# Altium schematic sheet PowerSchematic.SchDoc
size A4; SheetNumber: 1; SheetTotal: 3
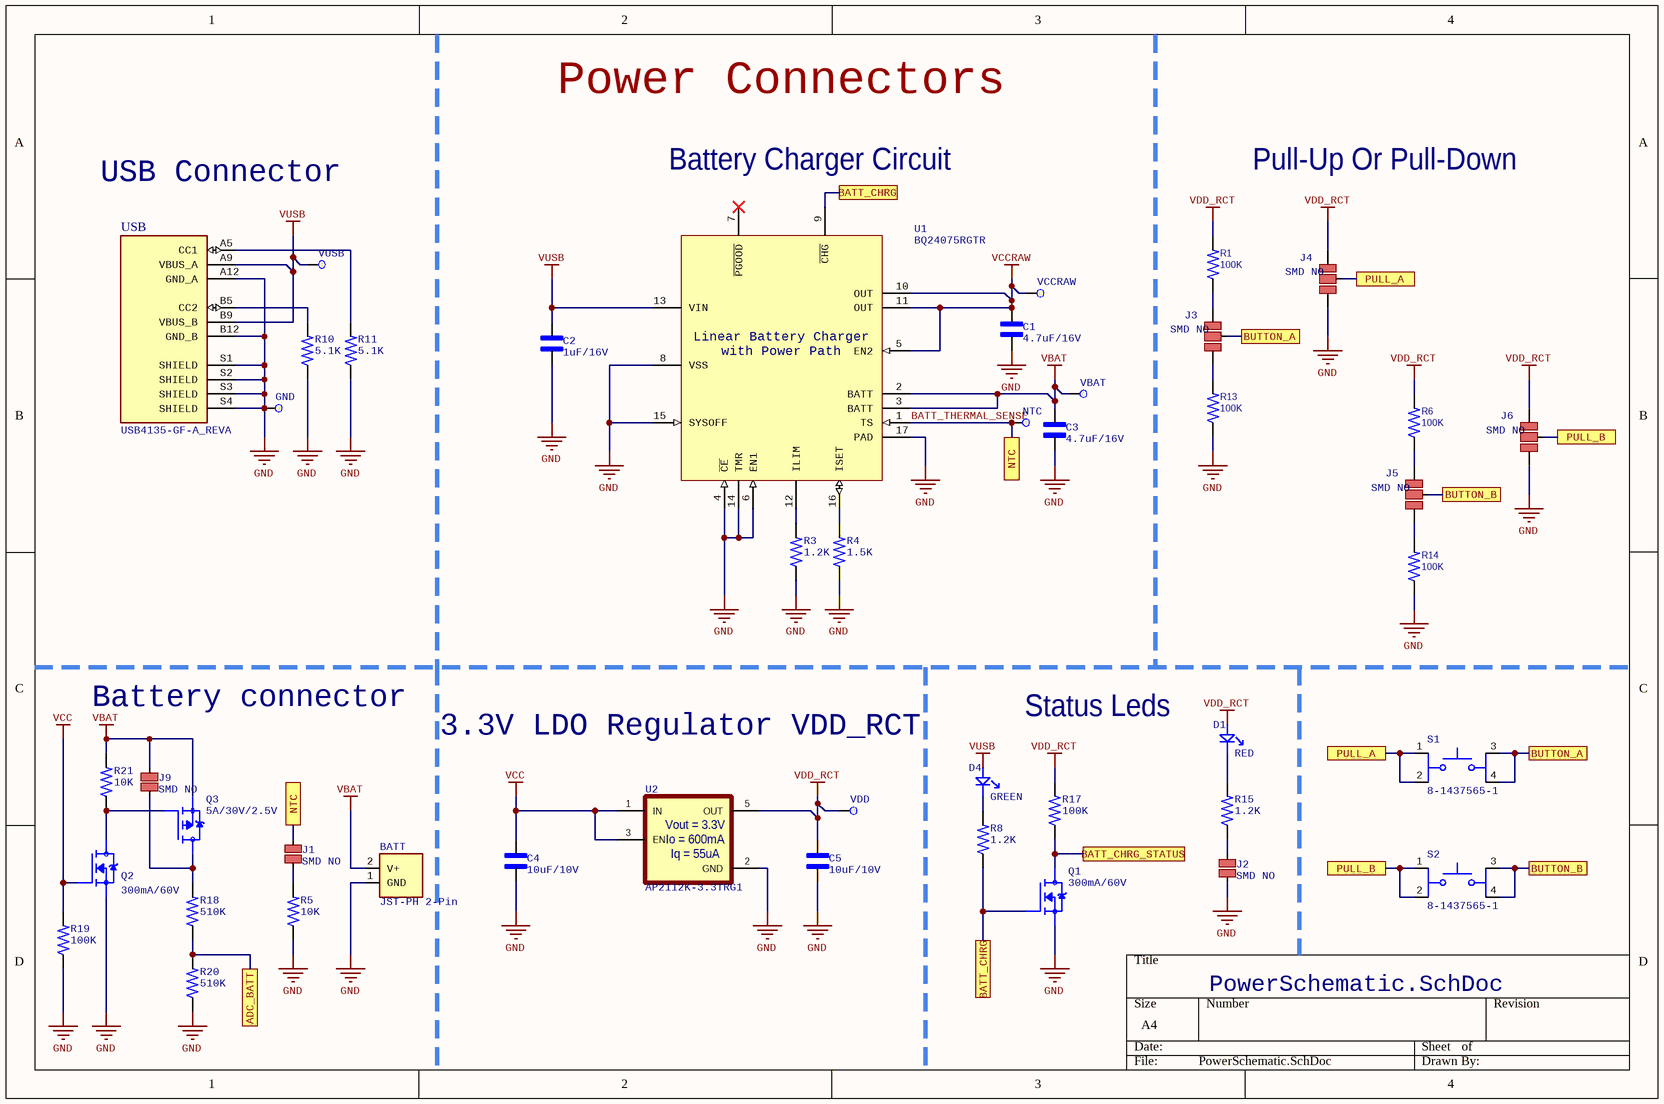
[diagram p0: PowerSchematic.SchDoc]

## Parts
BATT  JST-PH 2-Pin  [JST_B2B-PH-K-S(LF)(SN)]
C1  4.7uF/16V  [C0603]
C2  1uF/16V  [C0603]
C3  4.7uF/16V  [C0603]
C4  10uF/10V  [C0603]
C5  10uF/10V  [C0603]
D1  RED  [LED 0603]
D4  GREEN  [LED 0603]
GND  Test point 1.2mm  [TEST_POINT_1.2MM]  (value not drawn)  (no BOM)
J1  SMD NO  [JUMPER_SMD_NO]  (net tie, no BOM)
J2  SMD NO  [JUMPER_SMD_NO]  (net tie, no BOM)
J3  SMD NO  [JUMPER_SMD_NO_2WAY]  (net tie, no BOM)
J4  SMD NO  [JUMPER_SMD_NO_2WAY]  (net tie, no BOM)
J5  SMD NO  [JUMPER_SMD_NO_2WAY]  (net tie, no BOM)
J6  SMD NO  [JUMPER_SMD_NO_2WAY]  (net tie, no BOM)
J9  SMD NO  [JUMPER_SMD_NO]  (net tie, no BOM)
NTC  Test point 1.2mm  [TEST_POINT_1.2MM]  (value not drawn)  (no BOM)
Q1  300mA/60V  [SOT-23-3]
Q2  300mA/60V  [SOT-23-3]
Q3  5A/30V/2.5V  [SOT-23-3]
R1  100K  [R0603]
R3  1.2K  [R0603]
R4  1.5K  [R0603]
R5  10K  [R0603]
R6  100K  [R0603]
R8  1.2K  [R0603]
R10  5.1K  [R0603]
R11  5.1K  [R0603]
R13  100K  [R0603]
R14  100K  [R0603]
R15  1.2K  [R0603]
R17  100K  [R0603]
R18  510K  [R0603]
R19  100K  [R0603]
R20  510K  [R0603]
R21  10K  [R0603]
S1  8-1437565-1  [SW_8-1437565-1]
S2  8-1437565-1  [SW_8-1437565-1]
U1  BQ24075RGTR  [VQFN16]
U2  AP2112K-3.3TRG1  [SOT-25-5]
USB  USB4135-GF-A_REVA  [GCT_USB4135 16-pin]
VBAT  Test point 1.2mm  [TEST_POINT_1.2MM]  (value not drawn)  (no BOM)
VCCRAW  Test point 1.2mm  [TEST_POINT_1.2MM]  (value not drawn)  (no BOM)
VDD  Test point 1.2mm  [TEST_POINT_1.2MM]  (value not drawn)  (no BOM)
VUSB  Test point 1.2mm  [TEST_POINT_1.2MM]  (value not drawn)  (no BOM)

## Ports
ADC_BATT (see Peripherals[4C]), BATT_CHRG (see PowerSchematic[3A]), BATT_CHRG (see PowerSchematic[3D]), BATT_CHRG_STATUS (see Peripherals[4C]), BUTTON_A (see Peripherals[1C], PowerSchematic[3B]), BUTTON_A (see Peripherals[1C], PowerSchematic[4C]), BUTTON_B (see Peripherals[1C], PowerSchematic[4B]), BUTTON_B (see Peripherals[1C], PowerSchematic[4D]), NTC (see PowerSchematic[1D]), NTC (see PowerSchematic[3B]), PULL_A (see PowerSchematic[4B]), PULL_A (see PowerSchematic[4C]), PULL_B (see PowerSchematic[4B]), PULL_B (see PowerSchematic[4D])

## Nets
GND: BATT.1(GND) C1.2 C2.2 C3.2 C4.2 C5.2 GND.1 J2.2 J4.1 J6.1 Q1.2(S) Q2.2(S) R3.1 R4.1 R5.1 R10.1 R11.1 R13.1 R14.1 R19.1 R20.1 U1.4(~{CE}) U1.6(EN1) U1.8(VSS) U1.14(TMR) U1.15(SYSOFF) U1.17(PAD) U2.2(GND) USB.A12(GND_A) USB.B12(GND_B) USB.S1(SHIELD) USB.S2(SHIELD) USB.S3(SHIELD) USB.S4(SHIELD)
VBAT: BATT.2(V+) C3.1 J9.1 Q3.2(S) R21.2 U1.2(BATT) U1.3(BATT) VBAT.1
VCC: C4.1 Q2.1(G) R19.2 U2.1(IN) U2.3(EN)
VCCRAW: C1.1 U1.5(EN2) U1.10(OUT) U1.11(OUT) VCCRAW.1
VDD_RCT: C5.1 D1.1(A) J4.3 J6.3 R1.2 R6.2 R17.2 U2.5(OUT) VDD.1
VUSB: C2.1 D4.1(A) U1.13(VIN) USB.A9(VBUS_A) USB.B9(VBUS_B) VUSB.1
ADC_BATT: R18.1 R20.2 ; port ADC_BATT
BATT_CHRG: Q1.1(G) R8.1 U1.9(~{CHG}) ; port BATT_CHRG
BATT_CHRG_STATUS: Q1.3(D) R17.1 ; port BATT_CHRG_STATUS
BATT_THERMAL_SENSE: J1.1 NTC.1 U1.1(TS) ; port NTC
BUTTON_A: J3.2 S1.3 S1.4 ; port BUTTON_A
BUTTON_B: J5.2 S2.3 S2.4 ; port BUTTON_B
PULL_A: J4.2 S1.1 S1.2 ; port PULL_A
PULL_B: J6.2 S2.1 S2.2 ; port PULL_B
NetD1_2: D1.2(K) R15.2
NetD4_2: D4.2(K) R8.2
NetJ1_2: J1.2 R5.2
NetJ2_1: J2.1 R15.1
NetJ3_1: J3.1 R13.2
NetJ3_3: J3.3 R1.1
NetJ5_1: J5.1 R14.2
NetJ5_3: J5.3 R6.1
NetJ9_2: J9.2 Q3.3(D) R18.2
NetQ2_3: Q2.3(D) Q3.1(G) R21.1
NetR3_2: R3.2 U1.12(ILIM)
NetR4_2: R4.2 U1.16(ISET)
NetR10_2: R10.2 USB.B5(CC2)
NetR11_2: R11.2 USB.A5(CC1)

Not connected (* = marked no-connect by the designer): U1 7(~{PGOOD})*

## Notes on the sheet
- Power Connectors
- USB Connector
- Battery Charger Circuit
- Pull-Up Or Pull-Down
- Battery connector
- 3.3V LDO Regulator VDD_RCT
- Status Leds
- (in symbol AP2112K-3.3TRG1) Vout = 3.3V; Io = 600mA; Iq = 55uA
- (in symbol BQ24075RGTR) Linear Battery Charger; with Power Path

## Library data of the parts
BATT = JST-PH 2-Pin: JST (JAPAN SOLDERLESS TERMINALS) - B2B-PH-K-S(LF)(SN) - Pin Header, Top Entry, Wire-to-Board, 2 mm, 1 Rows, 2 Contacts, Through Hole, PH Series; Supplier 1: LCSC; Supplier Part Number 1: C131337; Manufacturer: JST; Manufacturer Part Number: B2B-PH-K-S(LF)(SN); RoHS: Yes; Category: Connectors; Stock 1: 3352380; Pricing 1: 20=0.03960, 200=0.03310, 600=0.02840, 2000=0.02160, 10000=0.02100, 20000=0.02070 (USD); Weight: 0.0625lb; Length: 0.2inch; Width: 0.24inch; Height: 0.35inch
C1 C3 = C0603 4.7uF/16V: 0603 4.7 uF 16 V ±10% Tolerance X5R Multilayer Ceramic Capacitor; Manufacturer: Murata; Manufacturer Part Number: GRT188R61C475KE13D; Value: 4.7uF; Voltage Rating: 16V; Supplier 1: Mouser; Supplier Part Number 1: 81-GRT188R61C475KE3D; RoHS: Yes; Category: Ceramic Capacitors; Stock 1: 39950; Pricing 1: 1=0.16, 10=0.066, 50=0.066, 100=0.038, 1000=0.034, 10000=0.029 (USD); Mounting Technology: Surface Mount; Case/Package: 0603; Case Code (Metric): 1608; Case Code (Imperial): 0603; Min Operating Temperature: -55°C; Max Operating Temperature: 85°C; Packaging: Cut Tape; Tolerance: 10%; Series: GRT; Length: 0.063inch; Width: 0.031inch; Thickness: 0.035inch; Ratings: AEC-Q200; RoHS Compliant: Yes
C2 = C0603 1uF/16V X5R: MLCC 1uF 16V X5R 10% SMD 0603 85C Paper T/R; Manufacturer: Yageo; Manufacturer Part Number: CC0603KRX5R7BB105; Dissipation Factor: 7%; Supplier 1: Mouser; Supplier Part Number 1: 603-CC603KRX5R7BB105; RoHS: Yes; Category: Ceramic Capacitors; Stock 1: 726921; Pricing 1: 1=0.17000, 10=0.09100, 50=0.09100, 100=0.04100, 1000=0.03400, 10000=0.02100 (USD); Mount: Surface Mount; Case/Package: 0603; Number of Pins: 2; Case Code (Imperial): 0603; Case Code (Metric): 1608; Min Operating Temperature: -55°C; Max Operating Temperature: 85°C; Capacitance: 1uF; Tolerance: 10%; Dielectric: X5R; Voltage Rating: 16V; Voltage Rating (DC): 16V; Packaging: Tape and Reel; Package Quantity: 4000; Termination: SMD/SMT; Resistor Type: Ceramic; Series: CC; Construction: Flat; Length: 1.6mm; Width: 0.8mm; Height: 0.8mm; Thickness: 0.035inch; Depth: 0.8mm; Radiation Hardening: No; REACH SVHC: Unknown; Lead Free: Lead Free; Halogen Free: Halogen Free; RoHS Compliant: Yes
C4 C5 = C0603 10uF/10V: MLCC 10uF 10V X5R 20% 0603; Manufacturer: Samsung; Manufacturer Part Number: CL10A106MP8NNND; Supplier 1: Mouser; Supplier Part Number 1: 187-CL10A106MP8NNND; RoHS: Yes; Category: Ceramic Capacitors; Stock 1: 58774; Pricing 1: 1=0.20000, 10=0.14000, 50=0.14000, 100=0.06600, 1000=0.03900, 10000=0.03000 (USD); Supplier 2: Mouser; Supplier Part Number 2: 963-LMK107BBJ106MAHT; RoHS Compliant: Yes
D1 = LED 0603 RED: Red 625nm LED Indication - Discrete 2V 0603; Manufacturer: Wurth Electronics; Manufacturer Part Number: 150060RS55040; Luminous Intensity: 90mcd; Lens Style: Flat; Viewing Angle: 140°; Dominant Wavelength: 624nm; Test Current: 20mA; Lens Transparency: Diffused; Lens Size: 0.8mm; Supplier 1: Mouser; Supplier Part Number 1: 710-150060RS55040; RoHS: No; Category: LEDs; Stock 1: 8586; Pricing 1: 1=0.18000, 10=0.16200, 100=0.14700, 500=0.13200, 1000=0.11700, 2000=0.11700 (USD); Mount: Surface Mount; Case/Package: 0603; Color: Red; Forward Voltage: 2V; Packaging: Tape and Reel; Height: 0.5mm; Case Code (Imperial): 0603; Case Code (Metric): 1608; Length: 1.6mm; Width: 0.8mm
D4 = LED 0603 GREEN: Green 575nm LED Indication - Discrete 2V 0603; Manufacturer: Wurth Electronics; Manufacturer Part Number: 150060VS55040; Luminous Intensity: 60mcd; Lens Style: Flat; Viewing Angle: 140°; Dominant Wavelength: 573nm; Test Current: 20mA; Lens Transparency: Diffused; Lens Size: 0.8mm; Supplier 1: Mouser; Supplier Part Number 1: 710-150060VS55040; RoHS: No; Category: LEDs; Stock 1: 24940; Pricing 1: 1=0,18000, 10=0,16200, 50=0,16200, 100=0,14700, 1000=0,11700, 10000=0,11700 (USD); Mount: Surface Mount; Case/Package: 0603; Color: Green; Forward Voltage: 2V; Packaging: Cut Tape; Height: 0.5mm; Case Code (Imperial): 0603; Case Code (Metric): 1608; Length: 1.6mm; Width: 0.8mm
GND NTC VBAT VCCRAW VDD VUSB = Test point: SMD test point
J1 J2 J9 = JUMPER_SMD_NO: Rule: UNIONINDEX=0|RULEKIND=ShortCircuit|NETSCOPE=AnyNet|LAYERKIND=SameLayer|NAME=Schematic Short-Circuit Constraint|ALLOWED=TRUE|UNIT=Imperial
J3-J6 = JUMPER_SMD_NO_2WAY
Q1 Q2 = MOSFET N-CH 2N7002,215: Trans MOSFET N-CH 60V 0.3A 3-Pin TO-236AB T/R; Manufacturer: Nexperia; Supplier 1: Mouser; Supplier Part Number 1: 771-2N7002-T/R; Manufacturer Part Number: 2N7002,215; RoHS: No; Category: MOSFETs; Stock 1: 82531; Pricing 1: 1=0.16000, 10=0.13800, 100=0.05900, 500=0.04800, 1000=0.03300, 3000=0.02500, 9000=0.02200, 24000=0.02000, 45000=0.01500 (USD)
Q3 = MOSFET P-CH 30V/5A SI2347DS-T1-GE3: P-Channel 30 V 42 mOhm 22 nC Surface Mount Power Mosfet - SOT-23-3; Manufacturer: Vishay Semiconductors; Rise Time: 6ns; Rds On Max: 42mR; Input Capacitance: 705pF; Drain to Source Voltage (Vdss): 30V; Continuous Drain Current (ID): 3.8A; Max Power Dissipation: 1.7W; Fall Time: 9ns; Gate to Source Voltage (Vgs): 20V; Drain to Source Resistance: 68mR; Turn-Off Delay Time: 19ns; Number of Elements: 1; Threshold Voltage: -2.5V; Element Configuration: Single; Drain to Source Breakdown Voltage: -30V; Supplier 1: Mouser; Supplier Part Number 1: 78-SI2347DS-T1-GE3; Manufacturer Part Number: Si2347DS-T1-GE3; RoHS: Yes; Category: MOSFETs; Stock 1: 90370; Pricing 1: 1=0.41000, 10=0.27600, 50=0.27600, 100=0.14500, 1000=0.10000, 10000=0.07700 (USD); Mount: Surface Mount; Case/Package: SOT-23-3; Number of Pins: 3; Contact Plating: Tin,Matte; Min Operating Temperature: -55°C; Max Operating Temperature: 150°C; Packaging: Tape and Reel; Package Quantity: 3000; Power Dissipation: 1.7W; Polarity: P-CHANNEL; Series: TrenchFET®; Radiation Hardening: No; REACH SVHC: No SVHC; Lead Free: Lead Free; RoHS Compliant: Yes
R1 R6 R13 R14 = R0603 100K: RES 0603 100K OHM 1% 1/10W; Manufacturer: Yageo; Manufacturer Part Number: RC0603FR-07100KL; Resistance: 100kR; Power Rating: 100mW; Voltage Rating: 50V; Temperature Coefficient: 100ppm/°C; Working Voltage: 75V; RoHS: Yes; Category: Chip SMD Resistors; Stock 1: 4536807; Pricing 1: 1=0.10000, 10=0.02100, 100=0.00900, 1000=0.00400, 5000=0.00300, 10000=0.00200 (USD); Case/Package: 0603; Number of Pins: 2; Case Code (Imperial): 0603; Case Code (Metric): 1608; Min Operating Temperature: -55°C; Max Operating Temperature: 155°C; Tolerance: 1%; Packaging: Tape and Reel; Resistor Type: Thick Film; Termination: SMD/SMT; Voltage Rating (DC): 50V; Length: 1.6mm; Depth: 0.8mm; REACH SVHC: No SVHC; Military Standard: Not; Lead Free: Lead Free; Supplier 1: Mouser; Supplier Part Number 1: 603-RC0603FR-07100KL; Number of Terminations: 2; Height: 0.45mm; Width: 0.8mm
R3 R8 R15 = R0603 1.2K: RES 0603 1.2K OHM 1% 1/10W; Manufacturer: Yageo; Manufacturer Part Number: RC0603FR-071K2L; Power Rating: 100mW; Voltage Rating: 50V; Resistance: 1.2kR; Temperature Coefficient: 100ppm/°C; Supplier 1: Mouser; Supplier Part Number 1: 603-RC0603FR-071K2L; RoHS: Yes; Category: Chip SMD Resistors; Stock 1: 27884; Pricing 1: 1=0.10000, 10=0.02400, 50=0.02400, 100=0.01000, 1000=0.00400, 10000=0.00300 (USD); Case/Package: 0603; Number of Pins: 2; Case Code (Imperial): 0603; Case Code (Metric): 1608; Size Code: 0603; Min Operating Temperature: -55°C; Max Operating Temperature: 155°C; Tolerance: 1%; Voltage Rating (DC): 50V; Packaging: Tape and Reel; Termination: SMD/SMT; Resistor Type: Thick Film; Features: Moisture Resistant; Series: RC; Max Power Dissipation: 100mW; Number of Terminations: 2; Construction: Rectangular; Resistance Tolerance: 1%; Length: 1.6mm; Width: 0.8mm; Height: 0.45mm; Depth: 0.8mm; REACH SVHC: No SVHC; Military Standard: Not; Lead Free: Lead Free; RoHS Compliant: Yes; ComponentLink1URL: http://www.farnell.com/datasheets/443971.pdf?src-supplier=Farnell; ComponentLink1Description: http://www.farnell.com/datasheets/443971.pdf?src-supplier=Farnell; ComponentLink2URL: http://www.farnell.com/datasheets/1868787.pdf?src-supplier=Farnell; ComponentLink2Description: http://www.farnell.com/datasheets/1868787.pdf?src-supplier=Farnell; ComponentLink3URL: http://www.farnell.com/datasheets/2167052.pdf?src-supplier=Farnell; ComponentLink3Description: http://www.farnell.com/datasheets/2167052.pdf?src-supplier=Farnell; ComponentLink4URL: http://www.mouser.com/ds/2/447/RC0603-272842.pdf?src-supplier=Mouser; ComponentLink4Description: http://www.mouser.com/ds/2/447/RC0603-272842.pdf?src-supplier=Mouser; ComponentLink5URL: http://components.arrow.com/part/dataview/0323_00047720?src-supplier=Arrow+Europe; ComponentLink5Description: http://components.arrow.com/part/dataview/0323_00047720?src-supplier=Arrow+Europe; ComponentLink6URL: http://www.farnell.com/datasheets/443971.pdf?src-supplier=Element14; ComponentLink6Description: http://www.farnell.com/datasheets/443971.pdf?src-supplier=Element14; ComponentLink7URL: http://www.farnell.com/datasheets/2167052.pdf?src-supplier=Newark; ComponentLink7Description: http://www.farnell.com/datasheets/2167052.pdf?src-supplier=Newark; ComponentLink8URL: http://www.farnell.com/datasheets/1868787.pdf?src-supplier=Element14; ComponentLink8Description: http://www.farnell.com/datasheets/1868787.pdf?src-supplier=Element14; ComponentLink9URL: http://www.farnell.com/datasheets/2167052.pdf?src-supplier=Element14; ComponentLink9Description: http://www.farnell.com/datasheets/2167052.pdf?src-supplier=Element14; ComponentLink10URL: http://www.yageo.com/documents/recent/PYu-RC0603_51_RoHS_L_7.pdf?src-supplier=Future+Electronics; ComponentLink10Description: http://www.yageo.com/documents/recent/PYu-RC0603_51_RoHS_L_7.pdf?src-supplier=Future+Electronics; ComponentLink11URL: https://www.verical.com/server-webapp/html/getDatasheet?partID=326670&src-supplier=Verical; ComponentLink11Description: https://www.verical.com/server-webapp/html/getDatasheet?partID=326670&src-supplier=Verical; ComponentLink12URL: http://www.farnell.com/datasheets/1868787.pdf?src-supplier=Newark; ComponentLink12Description: http://www.farnell.com/datasheets/1868787.pdf?src-supplier=Newark; ComponentLink13URL: http://www.yageo.com/documents/recent/PYu-RC_Group_51_RoHS_L_9.pdf?src-supplier=Digi-Key; ComponentLink13Description: http://www.yageo.com/documents/recent/PYu-RC_Group_51_RoHS_L_9.pdf?src-supplier=Digi-Key; ComponentLink14URL: http://www.yageo.com/documents/recent/PYu-RC_Group_51_RoHS_L_10.pdf?src-supplier=Digi-Key; ComponentLink14Description: http://www.yageo.com/documents/recent/PYu-RC_Group_51_RoHS_L_10.pdf?src-supplier=Digi-Key
R4 = R0603 1.5K: RES 0603 1.5K OHM 0.5% 1/10W; Manufacturer: Yageo; Manufacturer Part Number: RC0603FR-071K5L; Tolerance: 1%; Resistance: 1.5kR; Temperature Coefficient: 100ppm/°C; Voltage Rating (DC): 50V; Power Rating: 100mW; Supplier 1: Mouser; Supplier Part Number 1: 603-RC0603FR-071K5L; RoHS: Yes; Category: Chip SMD Resistors; Stock 1: 312486; Pricing 1: 1=0.10000, 10=0.01800, 50=0.01800, 100=0.00600, 1000=0.00500, 10000=0.00300 (USD); Case/Package: 0603; Number of Pins: 2; Case Code (Metric): 1608; Case Code (Imperial): 0603; Min Operating Temperature: -55°C; Max Operating Temperature: 155°C; Packaging: Tape and Reel; Resistor Type: Thick Film; Voltage Rating: 50V; Package Quantity: 1; Number of Terminations: 2; Termination: SMD/SMT; Max Power Dissipation: 100mW; Features: Moisture Resistant; Length: 0.063inch; Width: 0.031inch; Height: 0.022inch; Depth: 0.8mm; REACH SVHC: No SVHC; Lead Free: Lead Free; Military Standard: Not
R5 R21 = R0603 10K: SMD Chip Resistor, 10 kOhm, ± 1%, 100 mW, 0603 [1608 Metric], Thick Film, Anti-Sulfur; Manufacturer: Yageo; Manufacturer Part Number: AF0603FR-0710KL; Power Rating: 100mW; Temperature Coefficient: 100ppm/°C; Voltage Rating: 50V; Value: 10kR; Supplier 1: Mouser; Supplier Part Number 1: 603-AF0603FR-0710KL; RoHS: Yes; Category: Chip SMD Resistors; Case/Package: 0603; Case Code (Imperial): 0603; Case Code (Metric): 1608; Min Operating Temperature: -55°C; Max Operating Temperature: 155°C; Tolerance: 1%; Packaging: Tape and Reel; Package Quantity: 1; Termination: SMD/SMT; Number of Terminations: 2; Max Power Dissipation: 100mW; Features: Moisture Resistant,Anti-Sulfur; Length: 0.063inch; Width: 0.031inch; Height: 0.022inch; Lead Free: 5697LeadFree; Supplier 2: Mouser; Supplier Part Number 2: 667-ERJ-3EKF1002V; Stock 3: 5000; Pricing 3: 5000=0.00223, 10000=0.00219, 20000=0.00213 (USD); Series: AF; RoHS Compliant: Yes
R10 R11 = R0603 5.1K: RES 0603 5.1K OHM 1% 1/10W; Manufacturer: Yageo; Manufacturer Part Number: RC0603FR-075K1L; Power Rating: 100mW; Temperature Coefficient: 100ppm/°C; Resistance: 5.1kR; Voltage Rating: 50V; Supplier 1: Mouser; Supplier Part Number 1: 603-RC0603FR-075K1L; RoHS: Yes; Category: Chip SMD Resistors; Stock 1: 557916; Case/Package: 0603; Number of Pins: 2; Case Code (Imperial): 0603; Case Code (Metric): 1608; Min Operating Temperature: -55°C; Max Operating Temperature: 155°C; Tolerance: 1%; Packaging: Tape and Reel; Package Quantity: 1; Termination: SMD/SMT; Resistor Type: Thick Film; Number of Terminations: 2; Max Power Dissipation: 100mW; Voltage Rating (DC): 50V; Features: Moisture Resistant; Length: 0.063inch; Width: 0.031inch; Height: 0.022inch; Depth: 0.8mm; REACH SVHC: No SVHC; Military Standard: Not; Lead Free: Lead Free
R17 R19 = R0603 100K: RES 0603 100K OHM 1% 1/10W; Manufacturer: Yageo; Manufacturer Part Number: RC0603FR-07100KL; Power Rating: 100mW; Voltage Rating: 50V; Resistance: 100kR; Temperature Coefficient: 100ppm/°C; Working Voltage: 75V; Supplier 1: Mouser; Supplier Part Number 1: 603-RC0603FR-07100KL; RoHS: Yes; Category: Chip SMD Resistors; Stock 1: 4536807; Pricing 1: 1=0.10000, 10=0.02100, 100=0.00900, 1000=0.00400, 5000=0.00300, 10000=0.00200 (USD); Case/Package: 0603; Number of Pins: 2; Case Code (Imperial): 0603; Case Code (Metric): 1608; Min Operating Temperature: -55°C; Max Operating Temperature: 155°C; Tolerance: 1%; Voltage Rating (DC): 50V; Packaging: Tape and Reel; Termination: SMD/SMT; Resistor Type: Thick Film; Number of Terminations: 2; Length: 1.6mm; Width: 0.8mm; Height: 0.45mm; Depth: 0.8mm; REACH SVHC: No SVHC; Military Standard: Not; Lead Free: Lead Free
R18 R20 = R0603 510K: RES 0603 510K OHM 1% 1/10W; Manufacturer: TE Connectivity; Manufacturer Part Number: CPF0603B510KE; Tolerance: 0.1%; Temperature Coefficient: 25ppm/°C; Max Power Dissipation: 63mW; Resistance: 510kR; Supplier 1: Mouser; Supplier Part Number 1: 279-CPF0603B510KE; RoHS: Yes; Category: Uncategorized; Case/Package: 0603; Case Code (Imperial): 0603; Case Code (Metric): 1608; Min Operating Temperature: -55°C; Max Operating Temperature: 155°C; Packaging: Cut Tape; Number of Terminations: 2; Series: CPF, Neohm; RoHS Compliant: Yes; Stock 1: 16357; Pricing 1: 1=0.49, 10=0.329, 50=0.329, 100=0.187, 1000=0.1, 10000=0.092 (USD)
S1 S2 = 8-1437565-1: Switch Tactile OFF (ON) SPST Round Button Gull Wing 0.05A 24VDC 1.57N SMD T/R; Manufacturer: TE Connectivity Alcoswitch; Actuator Material: Brass; Mechanical Life: 500000Cycles; Illumination Type: Non-Illuminated; Contact Current Rating: 20mA; Switch Function: Off-Mom; Switch Travel: 0.25mm; Actuator Type: Standard; Max Voltage Rating (DC): 15V; Contact Resistance: 100mR; Number of Positions: 2NUMBER; Actuator Length: 0.4mm; Supplier 1: Mouser; Supplier Part Number 1: 506-8-1437565-1; Manufacturer Part Number: 8-1437565-1; RoHS: Yes; Category: Pushbutton Switches; Stock 1: 20150; Pricing 1: 1=0.72, 10=0.72, 50=0.72, 100=0.697, 1000=0.567, 10000=0.371 (USD); Mount: Surface Mount; Case/Package: SMD/SMT; Contact Material: Copper Alloy; Contact Plating: Silver; Min Operating Temperature: -35°C; Max Operating Temperature: 85°C; Packaging: Tape and Reel; Throw Configuration: SPST; Operating Force: 1.57N; Termination: Gull Wing; Series: FSMCT; Package Quantity: 4000; Type: Switch; Orientation: Straight; Electrical Life: 500000Cycles; Height: 1.7mm; Radiation Hardening: No; RoHS Compliant: Yes; Lead Free: 5697LeadFree; ELV: 5681ELVCompliant; ComponentLink1URL: https://datasheet.ciiva.com/8082/eng-cs-1308111-1-switches-core-program-catalog-0308-8082416.pdf?src-supplier=Avnet; ComponentLink1Description: https://datasheet.ciiva.com/8082/eng-cs-1308111-1-switches-core-program-catalog-0308-8082416.pdf?src-supplier=Avnet
U1 = BQ24075RGTR: IC LI-ION CHARGE MGMT 16-QFN; Manufacturer: Texas Instruments; Output Voltage: 4.2V; Output Current: 1.5A; Min Supply Voltage: 4.35V; Max Supply Voltage: 6.4V; Min Input Voltage: 4.3V; Number of Cells: 1; Interface: USB; Fault Protection: Over Voltage,Over Temperature,Short Circuit,Reverse Current; Battery Chemistry: LITHIUM-ION; Supplier 1: Mouser; Supplier Part Number 1: 595-BQ24075RGTR; Manufacturer Part Number: BQ24075RGTR; RoHS: Yes; Category: Battery Management; Stock 1: 21933; Pricing 1: 1=2.52000, 10=2.27000, 50=2.14000, 100=1.82000, 1000=1.24000, 10000=1.24000 (USD); Case/Package: VQFN; Number of Pins: 16; Weight: 0.000808oz; Contact Plating: Gold; Min Operating Temperature: -40°C; Max Operating Temperature: 125°C; Packaging: Tape and Reel; Package Quantity: 3000; Series: -; Max Charge Current: 1.5A; Battery Pack Voltage: 4.2V; Radiation Hardening: No; Lead Free: Lead Free; RoHS Compliant: Yes; ComponentLink1URL: https://datasheet.ciiva.com/15114/getdatasheetpartid-471953-15114762.pdf?src-supplier=Verical; ComponentLink1Description: https://datasheet.ciiva.com/15114/getdatasheetpartid-471953-15114762.pdf?src-supplier=Verical; ComponentLink2URL: https://datasheet.ciiva.com/3214/bq24079-3214043.pdf?src-supplier=Avnet; ComponentLink2Description: https://datasheet.ciiva.com/3214/bq24079-3214043.pdf?src-supplier=Avnet; ComponentLink3URL: https://datasheet.ciiva.com/1934/bq24072-1934514.pdf?src-supplier=Digi-Key; ComponentLink3Description: https://datasheet.ciiva.com/1934/bq24072-1934514.pdf?src-supplier=Digi-Key; Supplier 2: Digi-Key; Supplier Part Number 2: 296-38874-1-ND; Supplier 3: Digi-Key; Supplier Part Number 3: 296-38874-2-ND; Supplier 4: Arrow Electronics; Supplier Part Number 4: BQ24075RGTR
U2 = AP2112K-3.3TRG1: IC REG LINEAR 3.3V 600MA SOT25; Manufacturer: Diodes; Min Input Voltage: 2.5V; Number of Outputs: 1; Dropout Voltage: 250mV; Max Input Voltage: 6V; Quiescent Current: 55uA; Polarity: Positive; Accuracy: 1.5%; Output Type: Fixed; Supplier 1: Mouser; Supplier Part Number 1: 621-AP2112K-3.3TRG1; Manufacturer Part Number: AP2112K-3.3TRG1; RoHS: Yes; Category: Voltage Regulators - Linear; Stock 1: 4864; Pricing 1: 1=0.47000, 10=0.31700, 50=0.31700, 100=0.15000, 1000=0.11600, 10000=0.08900 (USD); Mount: Surface Mount; Case/Package: SOT-23-5; Number of Pins: 5; Min Operating Temperature: -40°C; Max Operating Temperature: 85°C; Package Quantity: 1; Packaging: Tape and Reel; Output Voltage: 3.3V; Output Current: 600mA; Number of Regulators: 1; Max Output Current: 600mA; Length: 3.1mm; Width: 1.7mm; Height: 1.3mm; Lead Free: Lead Free; RoHS Compliant: Yes; ComponentLink1URL: https://datasheet.ciiva.com/29569/ap2112-29569917.pdf?src-supplier=Digi-Key; ComponentLink1Description: https://datasheet.ciiva.com/29569/ap2112-29569917.pdf?src-supplier=Digi-Key; ComponentLink2URL: https://datasheet.ciiva.com/29569/ap2112-29569918.pdf?src-supplier=Digi-Key; ComponentLink2Description: https://datasheet.ciiva.com/29569/ap2112-29569918.pdf?src-supplier=Digi-Key; ComponentLink3URL: https://datasheet.ciiva.com/29569/ap2112-29569919.pdf?src-supplier=Digi-Key; ComponentLink3Description: https://datasheet.ciiva.com/29569/ap2112-29569919.pdf?src-supplier=Digi-Key; ComponentLink4URL: https://datasheet.ciiva.com/30016/ap2112-30016792.pdf?src-supplier=Avnet; ComponentLink4Description: https://datasheet.ciiva.com/30016/ap2112-30016792.pdf?src-supplier=Avnet
USB = USB4135-GF-A_REVA: Usb C Rec Gf Ra 6P SMT & SMT She; Manufacturer 1: Global Connector Technology; Supplier 1: Mouser; Supplier Part Number 1: 640-USB4135-GF-A; Manufacturer Part Number 1: USB4135-GF-A; RoHS: No; Category: Connectors; Stock 1: 1196; Pricing 1: 1=0.67300, 50=0.59700, 100=0.56000, 250=0.52200, 500=0.46600, 1000=0.43300, 1500=0.40000, 3000=0.33600 (USD)